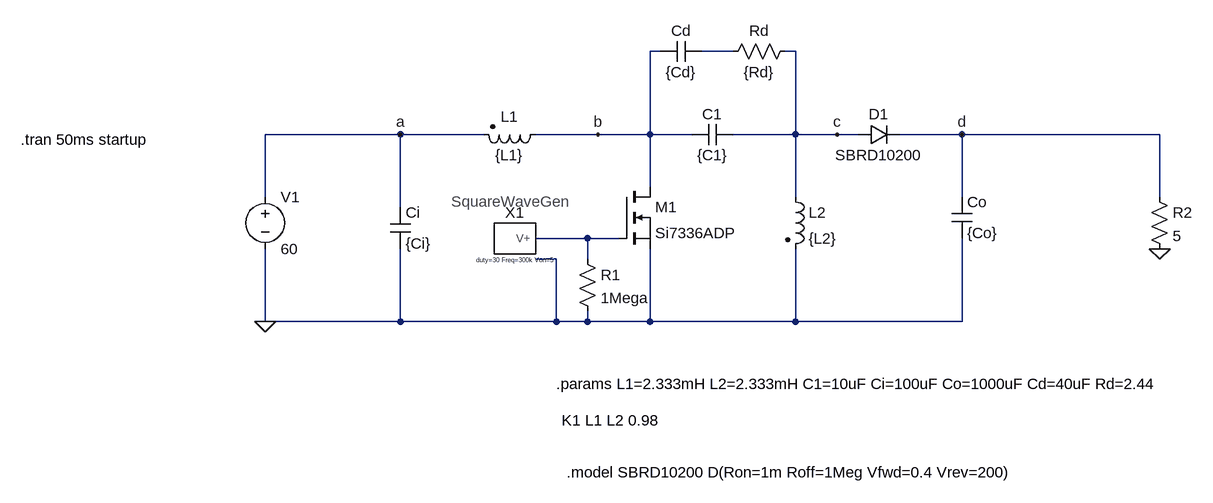
[diagram p0: schematic sepic_Benchmark.asc]
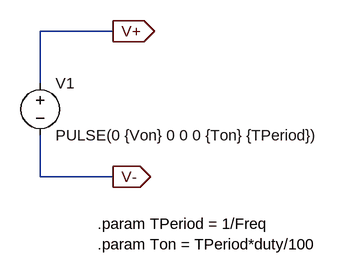
[diagram p1: sub-circuit swgen.asc]
sepic_Benchmark.asc, the LTspice schematic file:
Version 4
SHEET 1 1704 2112
WIRE 240 -64 224 -64
WIRE 352 -64 304 -64
WIRE 448 -64 432 -64
WIRE -160 64 -368 64
WIRE -32 64 -160 64
WIRE 144 64 48 64
WIRE 224 64 224 -64
WIRE 224 64 144 64
WIRE 288 64 224 64
WIRE 448 64 448 -64
WIRE 448 64 352 64
WIRE 512 64 448 64
WIRE 544 64 512 64
WIRE 704 64 608 64
WIRE 1008 64 704 64
WIRE 224 144 224 64
WIRE -368 160 -368 64
WIRE 448 160 448 64
WIRE 704 160 704 64
WIRE 1008 160 1008 64
WIRE -160 176 -160 64
WIRE 128 224 48 224
WIRE 176 224 128 224
WIRE 80 256 48 256
WIRE 128 256 128 224
WIRE -368 352 -368 240
WIRE -160 352 -160 240
WIRE -160 352 -368 352
WIRE 80 352 80 256
WIRE 80 352 -160 352
WIRE 128 352 128 336
WIRE 128 352 80 352
WIRE 224 352 224 240
WIRE 224 352 128 352
WIRE 448 352 448 240
WIRE 448 352 224 352
WIRE 704 352 704 224
WIRE 704 352 448 352
FLAG -368 352 0
FLAG 1008 240 0
FLAG -160 64 a
FLAG 144 64 b
FLAG 512 64 c
FLAG 704 64 d
SYMBOL cap -176 176 R0
SYMATTR InstName Ci
SYMATTR Value {Ci}
SYMBOL ind2 432 144 R0
SYMATTR InstName L2
SYMATTR Value {L2}
SYMATTR Type ind
SYMBOL cap 688 160 R0
SYMATTR InstName Co
SYMATTR Value {Co}
SYMBOL diode 544 80 R270
WINDOW 0 32 32 VTop 2
WINDOW 3 0 32 VBottom 2
SYMATTR InstName D1
SYMATTR Value SBRD10200
SYMBOL ind2 64 48 R90
WINDOW 0 4 56 VBottom 2
WINDOW 3 32 56 VTop 2
SYMATTR InstName L1
SYMATTR Value {L1}
SYMATTR Type ind
SYMBOL cap 352 48 R90
WINDOW 0 0 32 VBottom 2
WINDOW 3 32 32 VTop 2
SYMATTR InstName C1
SYMATTR Value {C1}
SYMBOL cap 304 -80 R90
WINDOW 0 0 32 VBottom 2
WINDOW 3 32 32 VTop 2
SYMATTR InstName Cd
SYMATTR Value {Cd}
SYMBOL res 448 -80 R90
WINDOW 0 0 56 VBottom 2
WINDOW 3 32 56 VTop 2
SYMATTR InstName Rd
SYMATTR Value {Rd}
SYMBOL res 112 240 R0
SYMATTR InstName R1
SYMATTR Value 1Mega
SYMBOL voltage -368 144 R0
WINDOW 123 0 0 Left 0
WINDOW 39 0 0 Left 0
SYMATTR InstName V1
SYMATTR Value 60
SYMBOL swgen 16 224 R0
SYMATTR InstName X1
SYMATTR SpiceLine duty=30 Freq=300k Von=5
SYMBOL nmos 176 144 R0
SYMATTR InstName M1
SYMATTR Value Si7336ADP
SYMATTR Prefix ""
SYMBOL res 992 144 R0
SYMATTR InstName R2
SYMATTR Value 5
TEXT 80 448 Left 2 !.params L1=2.333mH L2=2.333mH C1=10uF Ci=100uF Co=1000uF Cd=40uF Rd=2.44
TEXT -744 72 Left 2 !.tran 50ms startup
TEXT 88 504 Left 2 !K1 L1 L2 0.98
TEXT 96 584 Left 2 !.model SBRD10200 D(Ron=1m Roff=1Meg Vfwd=0.4 Vrev=200)

swgen.asc, the sub-circuit schematic file:
Version 4
SHEET 1 880 680
WIRE 208 16 96 16
WIRE 96 96 96 16
WIRE 96 240 96 176
WIRE 208 240 96 240
FLAG 208 16 V+
IOPIN 208 16 Out
FLAG 208 240 V-
IOPIN 208 240 Out
SYMBOL voltage 96 80 R0
WINDOW 123 0 0 Left 0
WINDOW 39 0 0 Left 0
SYMATTR InstName V1
SYMATTR Value PULSE(0 {Von} 0 0 0 {Ton} {TPeriod})
TEXT 184 312 Left 2 !.param TPeriod = 1/Freq
TEXT 184 344 Left 2 !.param Ton = TPeriod*duty/100

The netlist it stands for:
* sepic_Benchmark.asc
Ci a 0 {Ci}
L2 c 0 {L2}
Co d 0 {Co}
D1 c d SBRD10200
L1 b a {L1}
C1 c b {C1}
Cd N001 b {Cd}
Rd c N001 {Rd}
R1 N002 0 1Mega
V1 a 0 60
XX1 N002 swgen params: duty=30 Freq=300k Von=5
XM1 b N002 0 Si7336ADP  ; pins D G S
R2 d 0 5

* block symbol definitions
.subckt swgen V+
V1 V+ V- PULSE(0 {Von} 0 0 0 {Ton} {TPeriod})
.param TPeriod = 1/Freq
.param Ton = TPeriod*duty/100
.ends swgen

.model D D
.lib standard.dio
.params L1=2.333mH L2=2.333mH C1=10uF Ci=100uF Co=1000uF Cd=40uF Rd=2.44
.tran 50ms startup
K1 L1 L2 0.98
.model SBRD10200 D(Ron=1m Roff=1Meg Vfwd=0.4 Vrev=200)
.backanno
.end